# EAGLE design esp-box-emu (EAGLE 9.7.0)

## Sheet 1 of 2
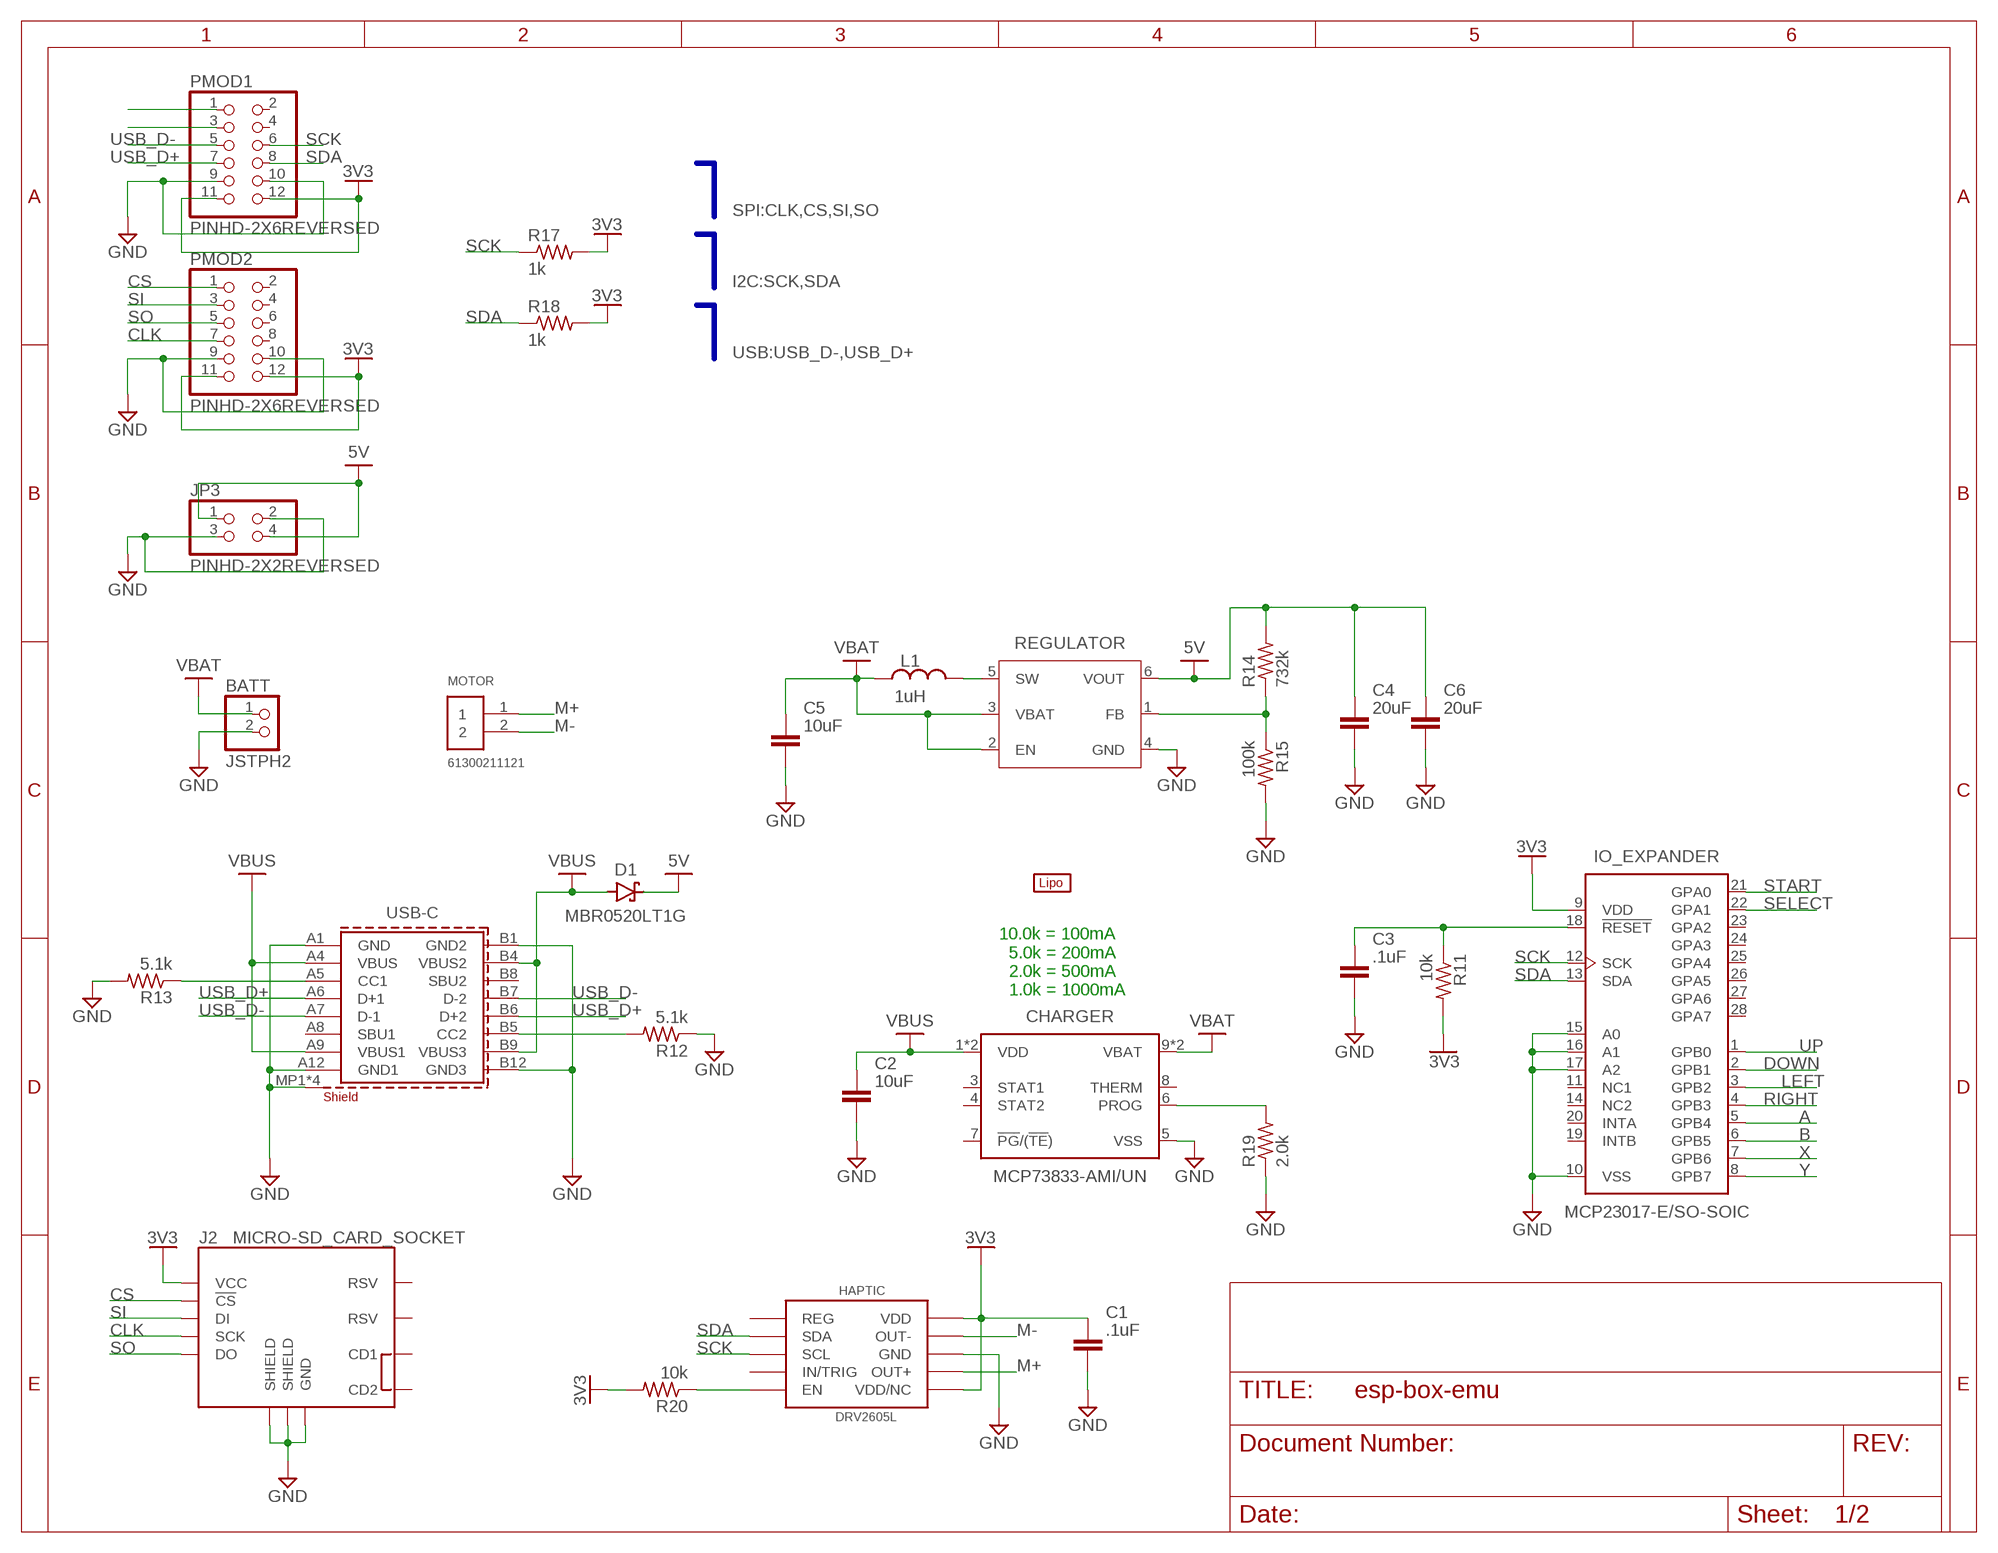
[diagram p0: schematic, sheet 1]

### Parts
BATT  JSTPH2  [JSTPH2]
BT1  LIPO-OUTLINE1100  [LIPO-1000]
C1  .1uF  C_CHIP-0603(1608-METRIC)  [CAPC1608X85]
C2  10uF  C_CHIP-0603(1608-METRIC)  [CAPC1608X85]
C3  .1uF  C_CHIP-0603(1608-METRIC)  [CAPC1608X85]
C4  20uF  C_CHIP-0805(2012-METRIC)  [CAPC2012X110]
C5  10uF  C_CHIP-0603(1608-METRIC)  [CAPC1608X85]
C6  20uF  C_CHIP-0805(2012-METRIC)  [CAPC2012X110]
CHARGER  MCP73833-AMI/UN  [SOP50P490X110-10]
D1  MBR0520LT1G  SCHOTTKY_MBR0520LT1GDO-219  [SODFL3718X115]
HAPTIC  DRV2605L  [VSSOP-10]
IO_EXPANDER  MCP23017-E/SO-SOIC  [SOIC127P1030X265-28]
J2  MICRO-SD_CARD_SOCKET  [MICRO-SD-SOCKET]
JP3  PINHD-2X2REVERSED  [2X02/EDGE_REVERSED]
L1  1uH  L_MOLDED-1210(3225-METRIC)  [INDM3225X240]
MOTOR  61300211121  [61300211121]
PMOD1  PINHD-2X6REVERSED  [2X06/EDGE_REVERSED]
PMOD2  PINHD-2X6REVERSED  [2X06/EDGE_REVERSED]
R11  10k  R-US_CHIP-0603(1608-METRIC)  [RESC1608X60]
R12  5.1k  R-US_CHIP-0603(1608-METRIC)  [RESC1608X60]
R13  5.1k  R-US_CHIP-0603(1608-METRIC)  [RESC1608X60]
R14  732k  R-US_CHIP-0603(1608-METRIC)  [RESC1608X60]
R15  100k  R-US_CHIP-0603(1608-METRIC)  [RESC1608X60]
R17  1k  R-US_CHIP-0603(1608-METRIC)  [RESC1608X60]
R18  1k  R-US_CHIP-0603(1608-METRIC)  [RESC1608X60]
R19  2.0k  R-US_CHIP-0603(1608-METRIC)  [RESC1608X60]
R20  10k  R-US_CHIP-0603(1608-METRIC)  [RESC1608X60]
REGULATOR  TPS61070  TPS61023  [SOT563]
USB-C  629722000214  629722000214SMD  [USB4110GFA]

### Nets
3V3: C1.1 HAPTIC.P$6(VDD/NC) HAPTIC.P$10(VDD) IO_EXPANDER.9(VDD) J2.VCC PMOD1.11 PMOD1.12 PMOD2.11 PMOD2.12 R11.2 R17.2 R18.2 R20.2 ; also sheet 2
5V: C4.1 C6.1 D1.1(C) JP3.1 JP3.4 R14.2 REGULATOR.6(VOUT)
A: IO_EXPANDER.5(GPB4) ; also sheet 2
B: IO_EXPANDER.6(GPB5) ; also sheet 2
CLK: J2.SCLK(SCK) PMOD2.7
CS: J2.CS(!CS) PMOD2.1
DOWN: IO_EXPANDER.2(GPB1) ; also sheet 2
GND: BATT.2 C1.2 C2.2 C3.2 C4.2 C5.2 C6.2 CHARGER.5(VSS) HAPTIC.P$8(GND) IO_EXPANDER.10(VSS) IO_EXPANDER.15(A0) IO_EXPANDER.16(A1) IO_EXPANDER.17(A2) J2.GND J2.GND1(SHIELD) J2.GND3(SHIELD) JP3.2 JP3.3 PMOD1.9 PMOD1.10 PMOD2.9 PMOD2.10 R12.1 R13.2 R15.2 R19.1 REGULATOR.4(GND) USB-C.A1(GND) USB-C.A12(GND1) USB-C.B1(GND2) USB-C.B12(GND3) USB-C.MP1(SHIELD) USB-C.MP2(SHIELD) USB-C.MP3(SHIELD) USB-C.MP4(SHIELD) ; also sheet 2
LEFT: IO_EXPANDER.3(GPB2) ; also sheet 2
M+: HAPTIC.P$7(OUT+) MOTOR.1
M-: HAPTIC.P$9(OUT-) MOTOR.2
N$2: C3.1 IO_EXPANDER.18(!RESET) R11.1
N$3: R12.2 USB-C.B5(CC2)
N$4: R13.1 USB-C.A5(CC1)
N$5: PMOD1.3
N$6: PMOD1.1
N$7: R14.1 R15.1 REGULATOR.1(FB)
N$8: L1.2 REGULATOR.5(SW)
N$9: CHARGER.6(PROG) R19.2
N$11: HAPTIC.P$5(EN) R20.1
RIGHT: IO_EXPANDER.4(GPB3) ; also sheet 2
SCK: HAPTIC.P$2(SCL) IO_EXPANDER.12(SCK) PMOD1.6 R17.1
SDA: HAPTIC.P$3(SDA) IO_EXPANDER.13(SDA) PMOD1.8 R18.1
SELECT: IO_EXPANDER.22(GPA1) ; also sheet 2
SI: J2.DI PMOD2.3
SO: J2.DO PMOD2.5
START: IO_EXPANDER.21(GPA0) ; also sheet 2
UP: IO_EXPANDER.1(GPB0) ; also sheet 2
USB_D+: PMOD1.7 USB-C.A6(D+1) USB-C.B6(D+2)
USB_D-: PMOD1.5 USB-C.A7(D-1) USB-C.B7(D-2)
VBAT: BATT.1 C5.1 CHARGER.9(VBAT) CHARGER.10(VBAT) L1.1 REGULATOR.2(EN) REGULATOR.3(VBAT)
VBUS: C2.1 CHARGER.1(VDD) CHARGER.2(VDD) D1.2(A) USB-C.A4(VBUS) USB-C.A9(VBUS1) USB-C.B4(VBUS2) USB-C.B9(VBUS3)
X: IO_EXPANDER.7(GPB6) ; also sheet 2
Y: IO_EXPANDER.8(GPB7) ; also sheet 2
Unconnected: CHARGER.3(STAT1) CHARGER.4(STAT2) CHARGER.7(!PG!/(!TE!)) CHARGER.8(THERM) HAPTIC.P$1(REG) HAPTIC.P$4(IN/TRIG) IO_EXPANDER.11(NC1) IO_EXPANDER.14(NC2) IO_EXPANDER.19(INTB) IO_EXPANDER.20(INTA) IO_EXPANDER.23(GPA2) IO_EXPANDER.24(GPA3) IO_EXPANDER.25(GPA4) IO_EXPANDER.26(GPA5) IO_EXPANDER.27(GPA6) IO_EXPANDER.28(GPA7) J2.CD1 J2.CD2 J2.RSV1(RSV) J2.RSV2(RSV) PMOD1.2 PMOD1.4 PMOD2.2 PMOD2.4 PMOD2.6 PMOD2.8 USB-C.A8(SBU1) USB-C.B8(SBU2)

### Buses
SPI:CLK,CS,SI,SO
I2C:SCK,SDA
USB:USB_D-,USB_D+

### Notes on the sheet
- 10.0k = 100mA
    5.0k = 200mA
    2.0k = 500mA
    1.0k = 1000mA

## Sheet 2 of 2
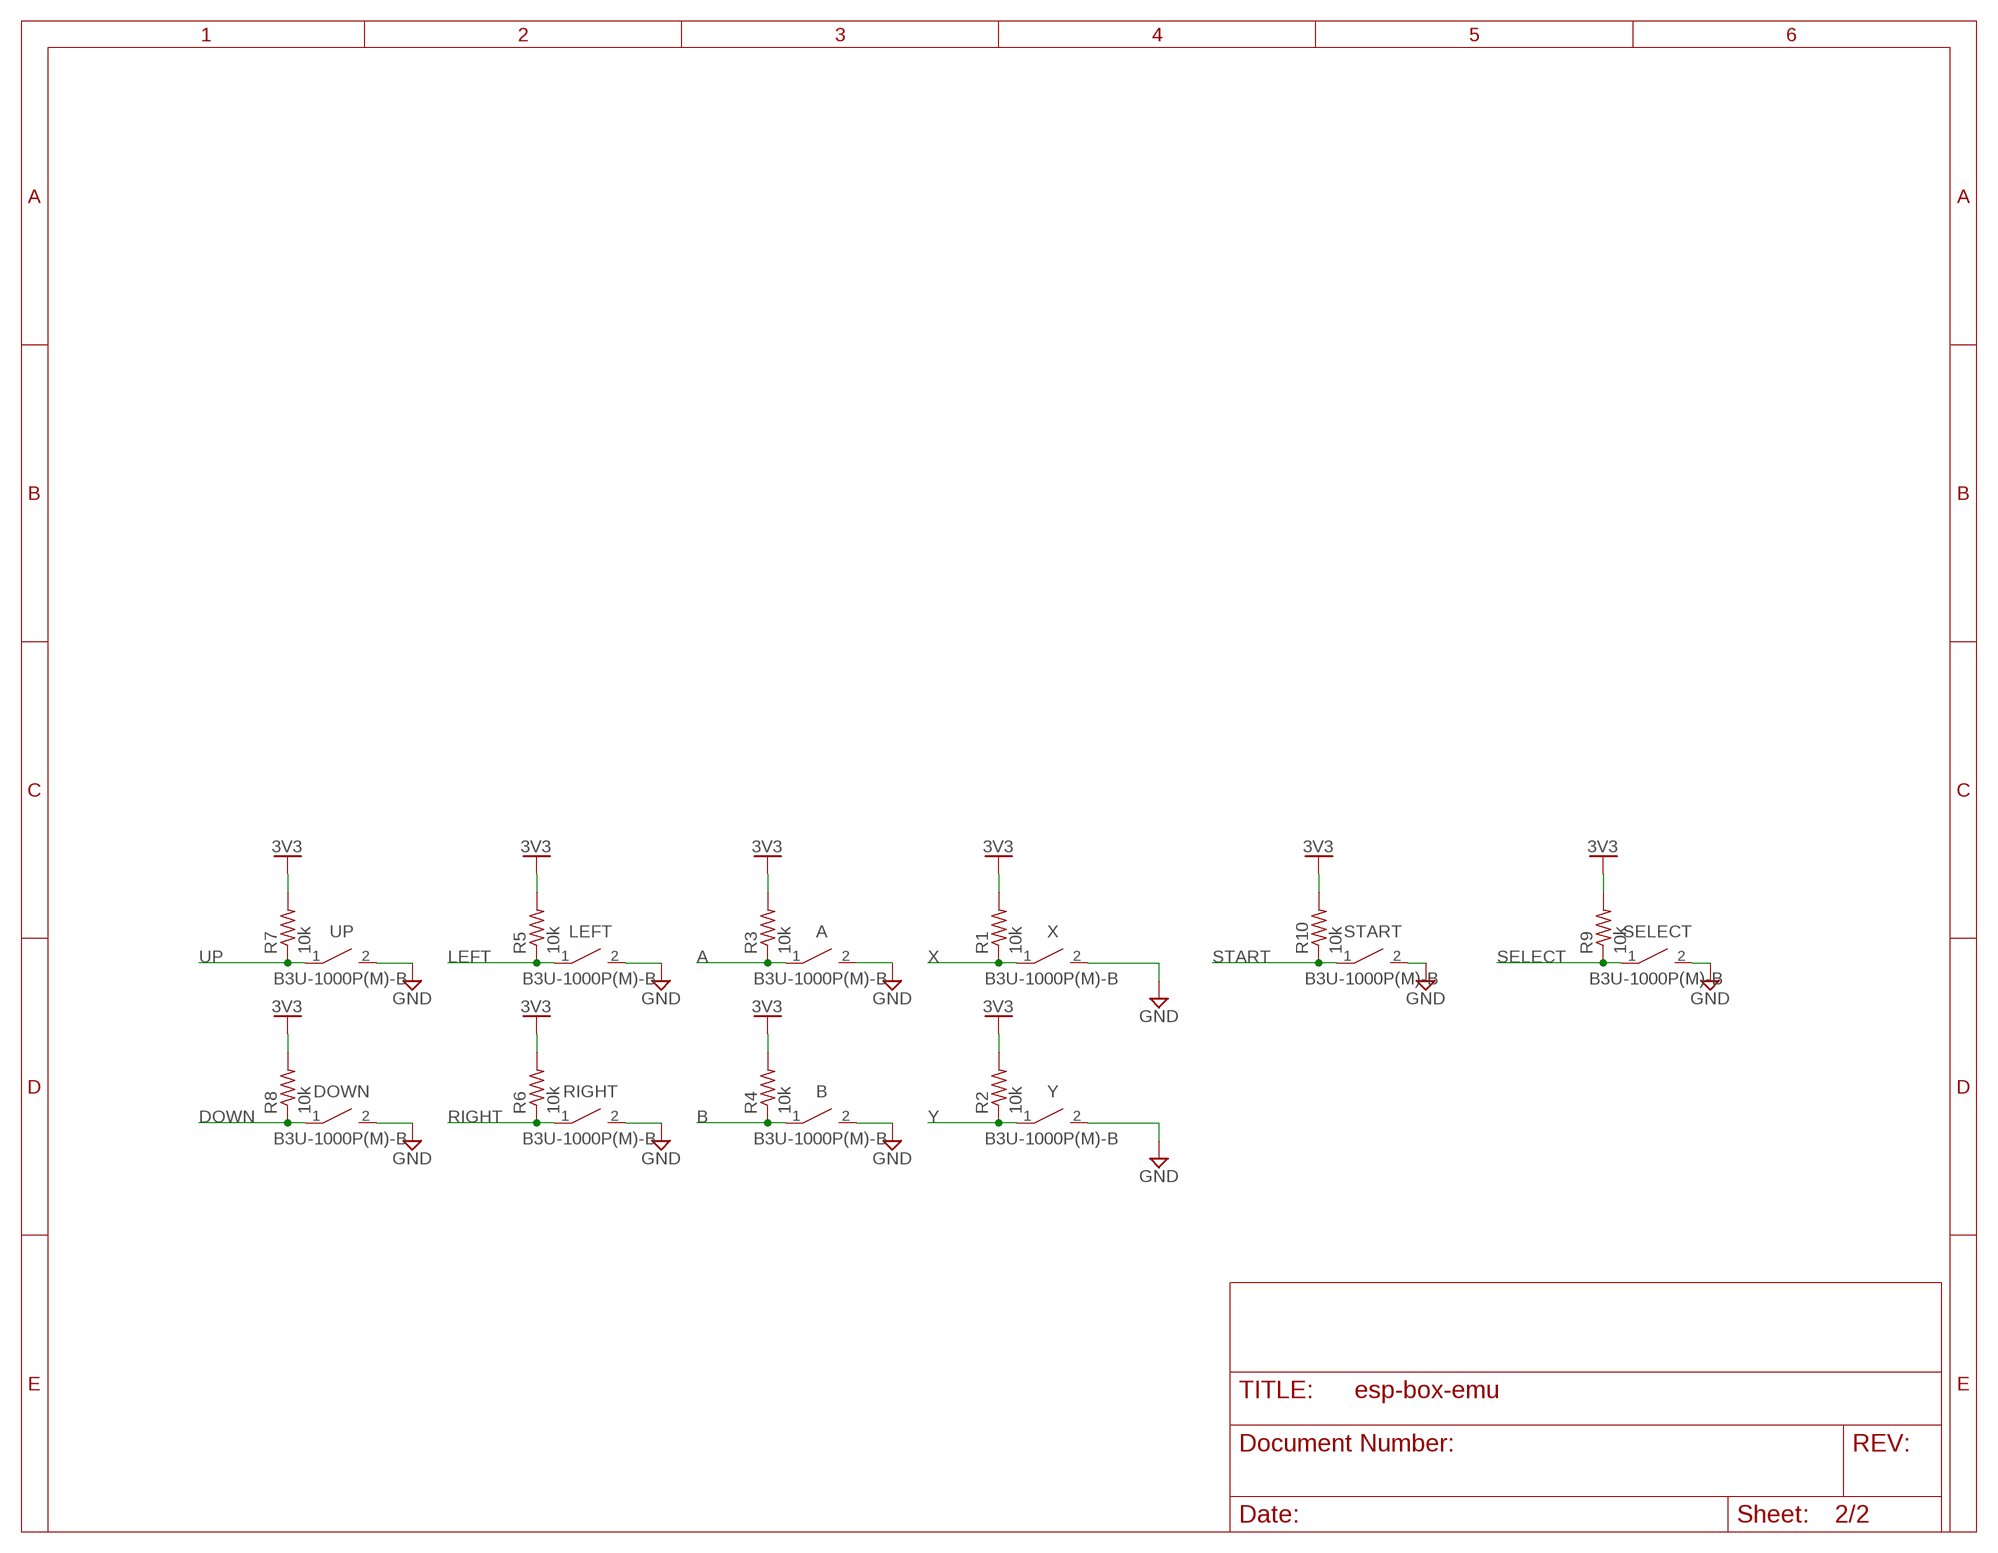
[diagram p1: schematic, sheet 2]

### Parts
A  B3U-1000P(M)-B  B3U-X000B3U-1000P(M)-B1000P(M)-B  [B3U-1000P(M)-B]
B  B3U-1000P(M)-B  B3U-X000B3U-1000P(M)-B1000P(M)-B  [B3U-1000P(M)-B]
DOWN  B3U-1000P(M)-B  B3U-X000B3U-1000P(M)-B1000P(M)-B  [B3U-1000P(M)-B]
LEFT  B3U-1000P(M)-B  B3U-X000B3U-1000P(M)-B1000P(M)-B  [B3U-1000P(M)-B]
R1  10k  R-US_CHIP-0603(1608-METRIC)  [RESC1608X60]
R2  10k  R-US_CHIP-0603(1608-METRIC)  [RESC1608X60]
R3  10k  R-US_CHIP-0603(1608-METRIC)  [RESC1608X60]
R4  10k  R-US_CHIP-0603(1608-METRIC)  [RESC1608X60]
R5  10k  R-US_CHIP-0603(1608-METRIC)  [RESC1608X60]
R6  10k  R-US_CHIP-0603(1608-METRIC)  [RESC1608X60]
R7  10k  R-US_CHIP-0603(1608-METRIC)  [RESC1608X60]
R8  10k  R-US_CHIP-0603(1608-METRIC)  [RESC1608X60]
R9  10k  R-US_CHIP-0603(1608-METRIC)  [RESC1608X60]
R10  10k  R-US_CHIP-0603(1608-METRIC)  [RESC1608X60]
RIGHT  B3U-1000P(M)-B  B3U-X000B3U-1000P(M)-B1000P(M)-B  [B3U-1000P(M)-B]
SELECT  B3U-1000P(M)-B  B3U-X000B3U-1000P(M)-B1000P(M)-B  [B3U-1000P(M)-B]
START  B3U-1000P(M)-B  B3U-X000B3U-1000P(M)-B1000P(M)-B  [B3U-1000P(M)-B]
UP  B3U-1000P(M)-B  B3U-X000B3U-1000P(M)-B1000P(M)-B  [B3U-1000P(M)-B]
X  B3U-1000P(M)-B  B3U-X000B3U-1000P(M)-B1000P(M)-B  [B3U-1000P(M)-B]
Y  B3U-1000P(M)-B  B3U-X000B3U-1000P(M)-B1000P(M)-B  [B3U-1000P(M)-B]

### Nets
3V3: R1.2 R2.2 R3.2 R4.2 R5.2 R6.2 R7.2 R8.2 R9.2 R10.2 ; also sheet 1
A: A.1 R3.1 ; also sheet 1
B: B.1 R4.1 ; also sheet 1
DOWN: DOWN.1 R8.1 ; also sheet 1
GND: A.2 B.2 DOWN.2 LEFT.2 RIGHT.2 SELECT.2 START.2 UP.2 X.2 Y.2 ; also sheet 1
LEFT: LEFT.1 R5.1 ; also sheet 1
RIGHT: R6.1 RIGHT.1 ; also sheet 1
SELECT: R9.1 SELECT.1 ; also sheet 1
START: R10.1 START.1 ; also sheet 1
UP: R7.1 UP.1 ; also sheet 1
X: R1.1 X.1 ; also sheet 1
Y: R2.1 Y.1 ; also sheet 1

## Library data of the parts
A B DOWN LEFT RIGHT SELECT START UP X Y = Switch:B3U-X000: Ultra-small Tactile Switch Contact form : SPST-NO Datasheet <https://omronfs.omron.com/en_US/ecb/products/pdf/en-b3u.pdf>; CATEGORY: Switch; DESCRIPTION: Ultra-small Surface-mounting Tactile Switches with High Contact Reliability; MANUFACTURER: OMRON; OPERATING_TEMPERATURE: -25°C to +70°C at 60%RH max; PART_STATUS: ACTIVE; ROHS_COMPLIANCE: RoHS Compliant; SERIES: B3U; TYPE: Tactile
BATT = Tutorial - Fusion 360:JSTPH2
BT1 = SparkFun-Batteries:LIPO-OUTLINE: LiPo Battery Outlines Outlines for common LiPo batteries sold by SparkFun. (Note: no terminals or connection points, just the dimensions.) SparkFun Products Polymer Lithium Ion Battery - 110mAh <https://www.sparkfun.com/products/13853> (PRT-13853) Polymer Lithium Ion Battery - 1000mAh <https://www.sparkfun.com/products/13813> (PRT-13813) Polymer Lithium Ion Battery - 2000mAh <https://www.sparkfun.com/products/8483> (PRT-08483); PROD_ID: BATT-13243; SF_SKU: PRT-13813
C1-C6 = Capacitor:C: Capacitor - Generic; CATEGORY: Capacitor
CHARGER = IC_Power-Management:MCP7383*: Li-Ion / Li-Polymer Charge Management Controller Datasheet <https://ww1.microchip.com/downloads/en/DeviceDoc/22005b.pdf>; CATEGORY: IC_Power-Management; DESCRIPTION: Charger IC Lithium Ion/Polymer 10-MSOP; MANUFACTURER: Microchip Technology; MPN: MCP73833-AMI/UN; OPERATING_TEMP: -40°C to 125°C; PART_STATUS: Active; ROHS_COMPLIANT: COMPLIANT; SERIES: -; SUB-CATEGORY: Battery Charger
D1 = Diode:SCHOTTKY_: Schottky Diode - Popular parts; CATEGORY: Diode; DESCRIPTION: DIODE SCHOTTKY 20V 500MA SOD123; MANUFACTURER: ON Semiconductor; MPN: MBR0520LT1G; SUB-CATEGORY: Schottky
HAPTIC = SparkFun-IC-Special-Function:DRV2605L; PROD_ID: IC-13504
IO_EXPANDER = IC_Interface:MCP23017*: 16-Bit I/O Expander with Serial Interface Datasheet <https://ww1.microchip.com/downloads/en/devicedoc/20001952c.pdf>; CATEGORY: IC_Interface; DESCRIPTION: I/O Expander 16 I²C 1.7MHz; MANUFACTURER: Microchip Technology; MPN: MCP23017-E/SO; OPERATING_TEMP: -40°C to 125°C; PART_STATUS: Active; ROHS_COMPLIANT: ROHS3 Compliant; SUB-CATEGORY: I/O Expander; TYPE: 16 bit
J2 = SparkFun-Connectors:MICRO-SD_CARD_SOCKET: microSD Socket for Transflash Push-push type µSD socket. tDoc lines correctly indicate media card edge positions when inserting (unlocked, locked, depressed). NOTE: CD1 and CD2 are connected internally, and the default detect state of the socket is detect pin to ground. SparkFun Products: WAV Trigger <https://www.sparkfun.com/products/13660> CAN-Bus Shield <https://www.sparkfun.com/products/13262> SparkFun Level Shifing microSD Breakout <https://www.sparkfun.com/products/13743>; PROD_ID: CONN-07820; SF_ID: PRT-00127
JP3 = My Connectors:PINHD-2X2: PIN HEADER
L1 = Inductor:L: Inductor Fixed - Generic; CATEGORY: Inductor; SUB-CATEGORY: Fixed
MOTOR = Headers:61300211121: CONN HEADER VERT 2POS 2.54MM Manufacturer's datasheet <https://katalog.we-online.de/em/datasheet/6130xx11121.pdf>; CREATED_BY: PCBLayout.com; DIGI_KEY_PART_NUMBER: 732-5315-ND; MANUFACTURER: Wurth Electronics Inc.; MPN: 61300211121
PMOD1 PMOD2 = My Connectors:PINHD-2X6: PIN HEADER
R1-R15 R17-R20 = Tutorial - Fusion 360:R-US: Resistor Fixed - ANSI; CATEGORY: Resistor; SUB-CATEGORY: Fixed
REGULATOR = Library:TPS61023: Synchronous Boost Converter With 600-mA Switch Datasheet <https://www.ti.com/lit/ds/symlink/tps61070.pdf?ts=1593507986589&ref_url=https%253A%252F%252Fwww.ti.com%252Fstore%252Fti%252Fen%252Fp%252Fproduct%252F%253Fp%253DTPS61070DDCR>
USB-C = Wurth_Connectors_WR-USB:629722000214: WR-COM USB 2.0 Type C Plug Vertical SMT Kind Properties Durability 10 000 Mating cycles Gender Receptacle Type Horizontal General Information Operating Temperature -40 up to +85 °C Electrical Properties Working Voltage 20 V (DC) Withstanding Voltage 100 V (AC) Contact Resistance 40 mΩ Material Properties Insulator Material LCP Insulator Flammability Rating UL94 V-0 Insulator Color Black Contact Material Brass Contact Plating Gold over Nickel Contact Type Stamped Shielding Material Steel Shielding Plating Nickel (Ni) <https://www.we-online.com/catalog/media/o689297v209%20family-wr-com-629722000214.jpg> Details see: www.we-online.com/catalog/WR-COM_USB_20_TYPE_C_RECEPTACLE_HORIZONTAL_SMT <www.we-online.com/catalog/WR-COM_USB_20_TYPE_C_RECEPTACLE_HORIZONTAL_SMT/?utm_source=eagle_model&utm_medium=description_link&utm_campaign=eisos_eagle> Updated by Ella Wu 2022-11-15 2022 (C) Würth Elektronik

## Board
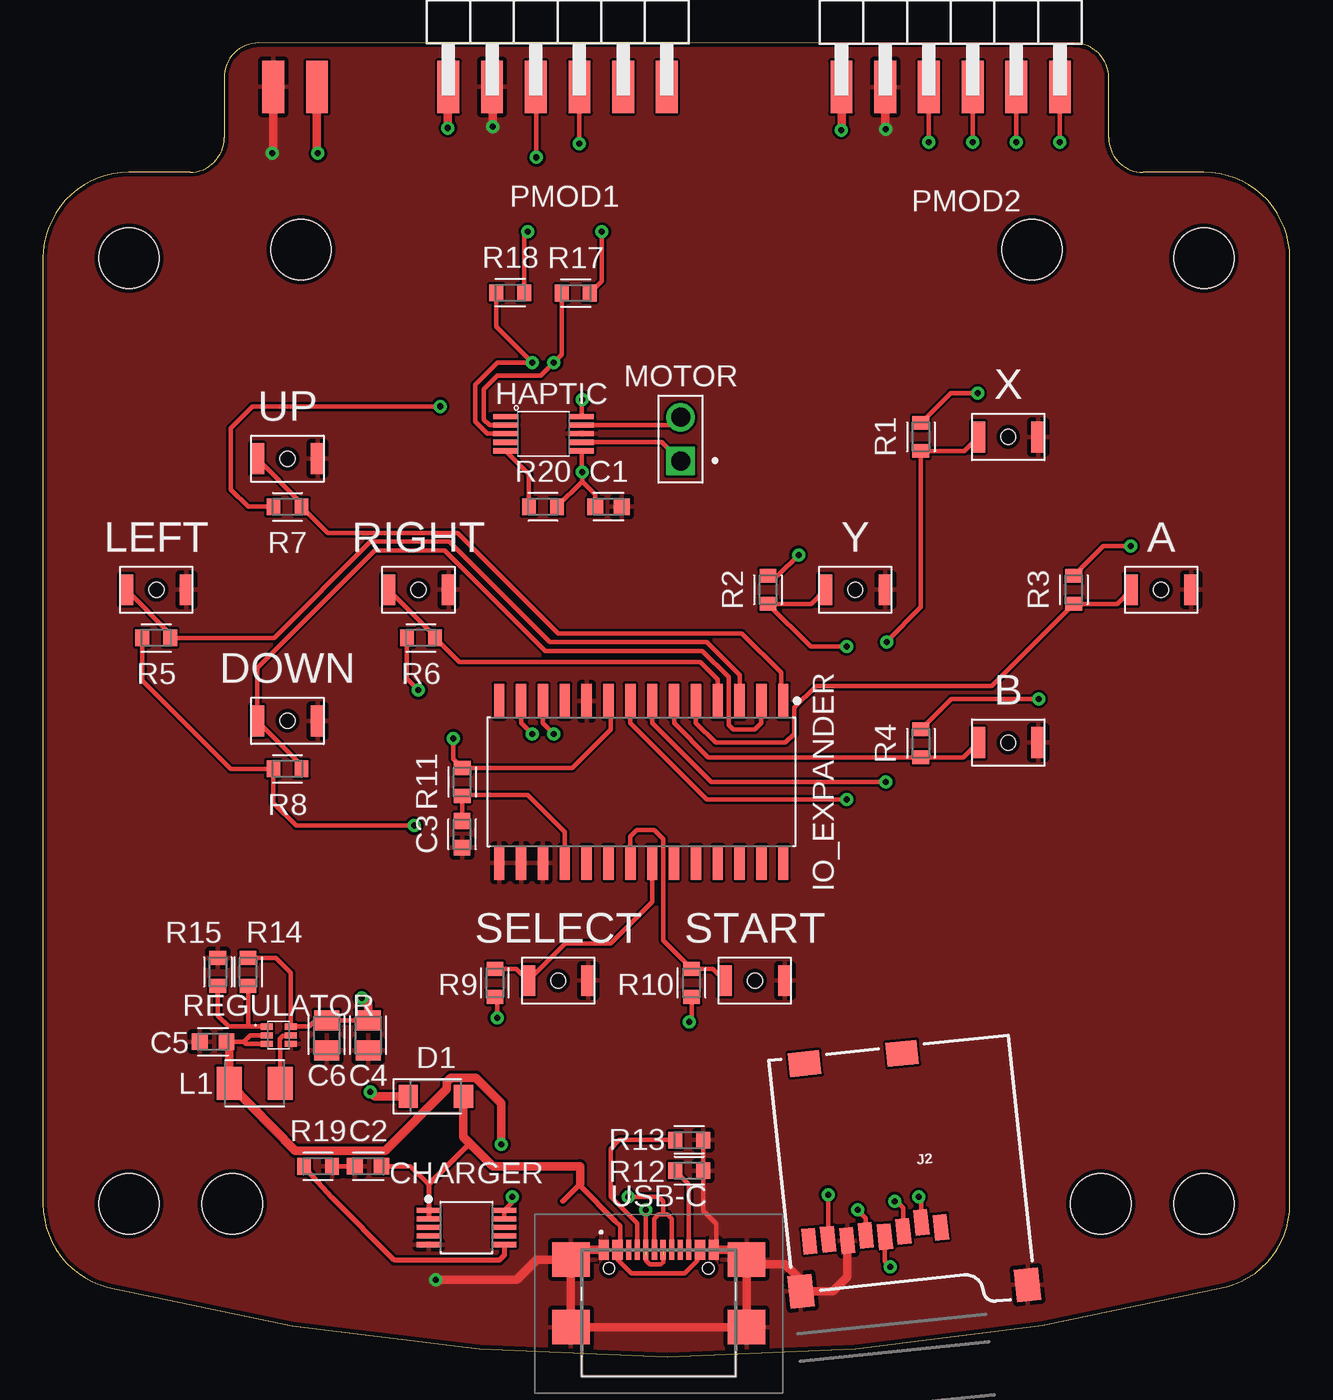
[diagram p2: board, top side]
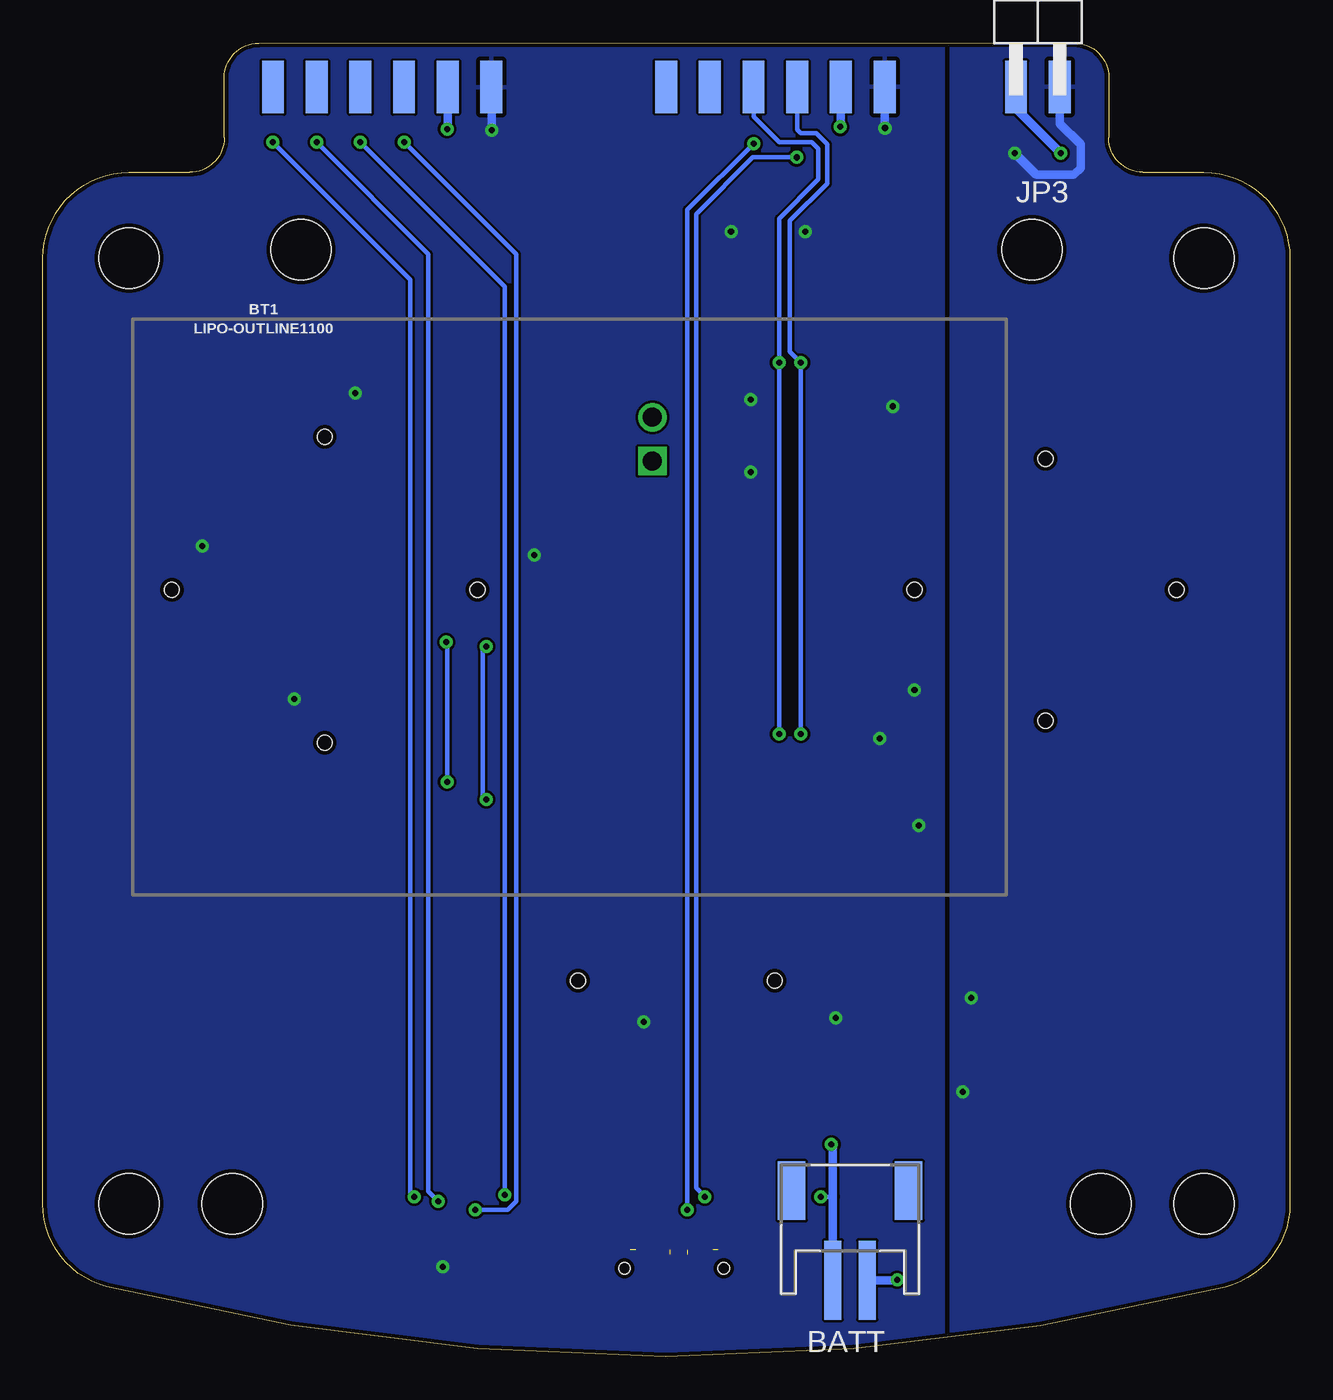
[diagram p3: board, bottom side, seen from below]

Size 72.5 x 76.4 mm. Coordinates in mm from the lower left corner, seen from the top.
Outline: 8.55,68.88 5,68.88 arc90 0,63.88 0,8.89 arc76 3.78,4.04 arc28 68.8,4.05 arc75 72.5,8.88 72.5,63.88 arc90 67.5,68.88 63.96,68.88 arc-90 61.96,70.88 61.96,74.38 arc90 59.96,76.38 12.52,76.4 arc90 10.54,74.4 10.54,70.88 arc-90 8.55,68.88
Copper layers (1*16): Top 0.035mm / dielectric 1.5mm / Bottom 0.035mm
Design rules "default *": minimum track width 6mil, minimum drill 0.35mm, track to track 6mil, track to pad 6mil, pad to pad 6mil, via to via 6mil, smd to smd 6mil, copper to edge 10mil, drill to drill 6mil, minimum pad ring 10mil, minimum via ring 8mil, stop-mask expansion 4mil, vias tented up to drill 0mil, thermal gap 10mil
Holes 3.5 mm at 67.5,63.88 5,63.88 5,8.89 67.5,8.88 15,64.38 57.5,64.38 11,8.88 61.5,8.88

### Footprints (pad centres in the part's own frame; a part is rotated, then mirrored left to right if it is on the bottom)
B3U-1000P(M)-B = smd 0.8 x 1.8: 1 -1.75,0; 2 1.75,0 | hole 0.85: 0,0
JSTPH2 = smd 1 x 4.6: 1 -1,-3.7; 2 1,-3.7 | smd 1.6 x 3.4: NC1 -3.4,1.5; NC2 3.4,1.5
CAPC1608X85 = smd 0.921 x 0.97: 1 -0.775,0; 2 0.775,0
CAPC2012X110 = smd 1.165 x 1.465: 1 -0.875,0; 2 0.875,0
SOP50P490X110-10 = smd 1.4 x 0.3: 1 -2.2,1; 2 -2.2,0.5; 3 -2.2,0; 4 -2.2,-0.5; 5 -2.2,-1; 6 2.2,-1; 7 2.2,-0.5; 8 2.2,0; 9 2.2,0.5; 10 2.2,1
SODFL3718X115 = smd 1.115 x 1.361: 1 -1.6,0; 2 1.6,0
VSSOP-10 = smd 1.45 x 0.3: P$1 -1.905,1.06; P$2 -1.905,0.56; P$3 -1.905,0.06; P$4 -1.905,-0.44; P$5 -1.905,-0.94; P$6 2.495,-0.94; P$7 2.495,-0.44; P$8 2.495,0.06; P$9 2.495,0.56; P$10 2.495,1.06
SOIC127P1030X265-28 = smd 2 x 0.6: 1 -4.7,8.255; 2 -4.7,6.985; 3 -4.7,5.715; 4 -4.7,4.445; 5 -4.7,3.175; 6 -4.7,1.905; 7 -4.7,0.635; 8 -4.7,-0.635; 9 -4.7,-1.905; 10 -4.7,-3.175; 11 -4.7,-4.445; 12 -4.7,-5.715; 13 -4.7,-6.985; 14 -4.7,-8.255; 15 4.7,-8.255; 16 4.7,-6.985; 17 4.7,-5.715; 18 4.7,-4.445; 19 4.7,-3.175; 20 4.7,-1.905; 21 4.7,-0.635; 22 4.7,0.635; 23 4.7,1.905; 24 4.7,3.175; 25 4.7,4.445; 26 4.7,5.715; 27 4.7,6.985; 28 4.7,8.255
MICRO-SD-SOCKET = smd 1.8 x 1.4: CD1 -2.05,0.4; CD2 -7.75,0.4 | smd 0.8 x 1.5: CS -7.84,10.3; DI -6.74,10.7; DO -2.34,10.7; GND -3.44,10.9; RSV1 -8.94,10.7; RSV2 -1.24,10.7; SCLK -4.54,10.7; VCC -5.64,10.9 | smd 1.4 x 1.9: GND1 -13.6,14.55; GND3 -0.45,13.55
2X02/EDGE_REVERSED = smd 1.27 x 3.048: 1 1.27,-2.794; 3 -1.27,-2.794 | smd 1.27 x 3.048 bottom: 2 1.27,-2.794; 4 -1.27,-2.794
INDM3225X240 = smd 1.459 x 1.929: 1 -1.478,0; 2 1.478,0
61300211121 = drill 1.1 square: 1 -1.27,0 | drill 1.1: 2 1.27,0
2X06/EDGE_REVERSED = smd 1.27 x 3.048: 1 6.35,3.556; 3 3.81,3.556; 5 1.27,3.556; 7 -1.27,3.556; 9 -3.81,3.556; 11 -6.35,3.556 | smd 1.27 x 3.048 bottom: 2 6.35,3.556; 4 3.81,3.556; 6 1.27,3.556; 8 -1.27,3.556; 10 -3.81,3.556; 12 -6.35,3.556
RESC1608X60 = smd 0.799 x 0.974: 1 -0.815,0; 2 0.815,0
SOT563 = smd 0.7 x 0.35: 1 -0.7,0.5; 2 -0.7,0; 3 -0.7,-0.5; 4 0.7,-0.5; 5 0.7,0; 6 0.7,0.5
USB4110GFA = smd 0.3 x 1.15: A1 -3.35,3.678; A4 -2.55,3.678; A5 -1.25,3.678; A6 -0.25,3.678; A7 0.25,3.678; A8 1.25,3.678; A9 2.55,3.678; A12 3.35,3.678; B1 3.05,3.678; B4 2.25,3.678; B5 1.75,3.678; B6 0.75,3.678; B7 -0.75,3.678; B8 -1.75,3.678; B9 -2.25,3.678; B12 -3.05,3.678 | smd 2.18 x 2: MP1 -5.11,-0.827; MP2 5.11,-0.827; MP3 -5.11,3.103; MP4 5.11,3.103 | hole 0.65: -2.89,2.603; 2.89,2.603

### Placement (x,y rotation side)
A  65.01,44.6 0 top
B  56.12,35.71 0 top
BATT  25.58,8.14 0 bottom
BT1  67.3,60.34 270 bottom
C1  32.88,49.42 0 top
C2  18.91,11.07 180 top
C3  24.37,30.37 270 top
C4  18.91,18.69 270 top
C5  9.89,18.31 180 top
C6  16.5,18.69 270 top
CHARGER  24.62,7.51 0 top
D1  22.85,15.13 0 top
DOWN  14.21,36.98 0 top
HAPTIC  28.81,53.61 0 top
IO_EXPANDER  34.78,33.42 270 top
J2  42.2,17.22 186 top
JP3  14.66,76.63 0 bottom
L1  12.3,15.89 0 top
LEFT  6.59,44.6 0 top
MOTOR  37.07,53.36 90 top
PMOD1  29.92,70.28 0 top
PMOD2  52.78,70.27 0 top
R1  51.04,53.49 90 top
R2  42.15,44.6 90 top
R3  59.93,44.6 90 top
R4  51.04,35.66 90 top
R5  6.59,41.8 180 top
R6  21.98,41.8 180 top
R7  14.21,49.42 180 top
R8  14.21,34.18 180 top
R9  26.27,21.74 270 top
R10  37.7,21.74 270 top
R11  24.37,33.42 90 top
R12  37.58,10.81 180 top
R13  37.58,12.59 0 top
R14  11.92,22.37 90 top
R15  10.17,22.37 90 top
R17  30.97,61.85 0 top
R18  27.16,61.87 0 top
R19  15.99,11.07 180 top
R20  29.07,49.42 0 top
REGULATOR  13.7,18.69 0 top
RIGHT  21.83,44.6 0 top
SELECT  29.96,21.86 0 top
START  41.39,21.86 0 top
UP  14.21,52.22 0 top
USB-C  35.8,2.53 0 top
X  56.12,53.49 0 top
Y  47.23,44.6 0 top

### Tracks (layer width: path | path; a pad name or v marks a point on that pad's centre or on a via)
3V3  (via drill 0.35)
  Top 0.254: IO_EXPANDER.9 33.01,37.99 33.01,36.47 30.77,34.23 R11.2 23.86,34.74 v23.86,35.96 | R1.2 52.77,56.03 v54.34,56.03 | R3.2 61.66,47.14 v63.23,47.14 | R4.2 52.81,38.25 v57.9,38.25 | R2.2 42.71,45.41 v43.93,46.63 | R5.2 5.77,39.31 10.91,34.18 R8.2 13.39,32.2 14.72,30.88 v21.58,30.88 | R7.2 11.92,49.42 10.91,50.44 10.91,53.99 12.18,55.26 v23.1,55.26 | R18.2 27.98,65.22 v28.18,65.42 | R17.2 32.5,62.56 v32.5,65.42 | R6.2 21.16,39.42 v21.83,38.75 | R9.2 26.4,20.79 v26.4,19.7 | R10.2 37.7,19.58 v37.58,19.45 | J2.VCC 48.95,5.54 v49.26,5.23 | HAPTIC.P$6 31.31,51.5 v31.35,51.45 31.35,50.89 | R20.2 31.35,50.89 | HAPTIC.P$10 31.31,55.6 v31.35,55.64 | C1.1 32.1,50.14 31.35,50.89
  Top 0.508: PMOD2.12 46.43,71.43 46.47,71.39 v46.4,71.33 | v23.54,71.46 23.54,73.82 PMOD1.12
  Bottom 0.508: v46.4,71.33 46.4,73.8 PMOD2.12 | PMOD1.12 23.57,71.56 23.61,71.52 v23.54,71.46
  pour Bottom: 20.18,-1 73.27,-1 73.27,76.47 20.18,76.47
5V  (via drill 0.35)
  Top 0.254: R14.2 13.52,23.19 14.4,22.31 REGULATOR.6 15.47,19.19 15.75,19.46 C6.1 C4.1
  Top 0.508: D1.1 19.29,15.13 v19.04,15.39 | JP3.4 15.93,70.03 v15.99,69.98 | C4.1 18.91,20.47 v18.53,20.85
  Bottom 0.508: JP3.1 13.39,71.71 12.18,70.5 12.18,69.11 12.56,68.73 14.74,68.73 v15.99,69.98
  pour Bottom: -0.14,-1 19.67,-1 19.67,76.47 -0.14,76.47
A
  Top 0.254: A.1 62.44,43.78 R3.1 55.16,39.01 44.94,39.01 43.67,37.74 43.67,36.21 43.17,35.71 39.1,35.71 37.96,36.85 IO_EXPANDER.5
B
  Top 0.254: B.1 53.51,34.85 R4.1 38.69,34.85 36.69,36.85 IO_EXPANDER.6
CLK  (via drill 0.35)
  Top 0.254: PMOD2.7 v51.51,70.63 | J2.SCLK 47.84,8.05 v47.36,8.53
  Bottom 0.254: v51.51,70.63 44.99,64.11 44.99,9.02 45.48,8.53 v47.36,8.53
CS  (via drill 0.35)
  Top 0.254: PMOD2.1 v59.13,70.63 | J2.CS 51.08,9.13 v50.91,9.29
  Bottom 0.254: v59.13,70.63 51.14,62.64 51.14,9.52 v50.91,9.29
DOWN
  Top 0.254: R8.1 15.02,34.41 DOWN.1 12.46,40.05 19.29,46.88 23.35,46.88 29.2,41.04 38.34,41.04 39.86,39.52 39.86,36.72 40.12,36.47 41.39,36.47 41.77,36.85 IO_EXPANDER.2
GND  (via drill 0.35)
  Top 0.254: R13.2 R12.1 38.39,8.47 39.15,7.72 USB-C.A12 | R19.1 C2.2
  Top 0.508: v49.01,71.39 48.97,71.43 PMOD2.10 | PMOD1.10 26.15,73.8 v26.15,71.52 | JP3.2 13.39,70.06 v13.32,70 | J2.GND 46.76,4.63 45.93,3.8 J2.GND3 44.06,4.45 43.14,5.37 40.91,5.37 | 40.91,5.37 | 40.91,5.37 USB-C.MP4 40.34,6.21 USB-C.A12 | 40.91,5.37 USB-C.MP2 | USB-C.MP2 | USB-C.MP3 USB-C.MP1 USB-C.MP2 | USB-C.MP3 31.27,6.21 USB-C.A1 | USB-C.MP3 28.72,5.64 27.55,4.46 v22.85,4.46
  Bottom 0.508: BATT.2 22.87,4.44 v22.85,4.46 | PMOD2.10 48.97,71.43 v49.01,71.39 | v26.15,71.52 26.11,71.56 PMOD1.10 | JP3.3 15.93,72.6 v13.32,70
  pour Top: -0.14,-1 73.27,-1 73.27,76.47 -0.14,76.47
LEFT
  Top 0.254: LEFT.1 7.41,42.03 R5.1 13.45,41.8 19.04,47.39 23.61,47.39 29.45,41.55 38.59,41.55 40.5,39.64 IO_EXPANDER.3
M+
  Top 0.254: HAPTIC.P$7 35.99,53.17 MOTOR.1
M-
  Top 0.254: HAPTIC.P$9 36.61,54.17 MOTOR.2
N$2
  Top 0.254: IO_EXPANDER.18 30.34,30.5 28.18,32.66 24.42,32.66 R11.1 C3.1
N$3
  Top 0.254: R12.2 37.55,10.03 USB-C.B5
N$4
  Top 0.254: R13.1 33.51,12.59 33.01,12.08 33.01,9.29 34.55,7.75 USB-C.A5
N$7
  Top 0.254: R15.1 10.17,19.81 10.79,19.19 11.92,19.19 | 11.92,19.19 REGULATOR.1 | R14.1 11.92,19.19
N$8
  Top 0.254: REGULATOR.5 14.36,18.64 13.94,18.64 13.77,18.48 13.77,17.9 13.78,17.89 L1.2
N$9
  Top 0.305: R19.2 16.8,9.24 20.43,5.61 26.53,5.61 26.82,5.9 CHARGER.6
N$11
  Top 0.254: HAPTIC.P$5 28.25,51.33 R20.1
RIGHT
  Top 0.254: RIGHT.1 22.79,41.88 R6.1 24.19,40.4 38.21,40.4 39.23,39.39 IO_EXPANDER.4
SCK  (via drill 0.35)
  Top 0.254: R17.1 30.16,58.26 v29.7,57.8 28.94,57.04 26.4,57.04 25.64,56.28 25.64,54.5 25.97,54.17 HAPTIC.P$2 | v29.7,36.21 29.07,36.85 IO_EXPANDER.12
  Bottom 0.254: v29.7,36.21 v29.7,57.8 29.7,66.19 27.42,68.47 27.42,70.25 27.8,70.63 29.7,70.63 31.19,72.12 PMOD1.6
SDA  (via drill 0.35)
  Top 0.254: R18.1 26.35,59.89 v28.43,57.8 26.4,57.8 25.13,56.53 25.13,54.37 25.83,53.67 HAPTIC.P$3 | v28.43,36.21 27.8,36.85 IO_EXPANDER.13
  Bottom 0.254: v28.43,36.21 v28.43,57.8 29.07,58.44 29.07,66.06 26.91,68.22 26.91,70.5 27.55,71.14 28.43,71.14 28.65,71.35 PMOD1.8
SELECT
  Top 0.254: R9.1 27.52,22.55 SELECT.1 30.37,24.02 33.01,24.02 35.42,26.43 IO_EXPANDER.22
SI  (via drill 0.35)
  Top 0.254: PMOD2.3 v56.59,70.63 | J2.DI 50.02,8.66 49.64,9.04 v49.52,9.04
  Bottom 0.254: v56.59,70.63 50.09,64.13 50.09,9.61 v49.52,9.04
SO  (via drill 0.35)
  Top 0.254: PMOD2.5 v54.05,70.63 | v45.65,9.42 J2.DO
  Bottom 0.254: v54.05,70.63 45.65,62.23 v45.65,9.42
START
  Top 0.254: IO_EXPANDER.21 34.15,30.24 34.53,30.63 35.55,30.63 36.05,30.12 36.05,24.2 R10.1 38.95,22.55 START.1
UP
  Top 0.254: UP.1 15.02,49.65 R7.1 16.55,47.9 24.12,47.9 29.96,42.06 40.63,42.06 42.91,39.77 42.91,38.25 IO_EXPANDER.1
USB_D+  (via drill 0.35)
  Top 0.254: 36.05,8.27 35.8,8.27 35.55,8.02 USB-C.A6 | 36.05,8.27 36.31,8.27 36.56,8.02 36.56,6.22 USB-C.B6 | 36.05,8.27 36.05,9.04 35.8,9.29 v34.02,9.29 | v28.69,69.74 28.69,73.8 PMOD1.7
  Bottom 0.254: v34.02,9.29 34.53,9.8 34.53,66.44 31.23,69.74 v28.69,69.74
USB_D-  (via drill 0.35)  (2 unrouted)
  Top 0.254: v31.19,70.54 PMOD1.5 | 35.05,5.95 35.04,5.96 35.04,5.6 35.29,5.35 35.93,5.35 36.05,5.48 USB-C.A7 | USB-C.B7 35.04,6.22 v35.04,8.53 | 36.05,5.95
  Bottom 0.254: v35.04,8.53 35.04,66.69 v31.19,70.54
VBAT  (via drill 0.35)
  Top 0.254: CHARGER.9 CHARGER.10 27.29,8.98 v27.29,9.29 | C5.1 11.67,18.31 | 11.67,18.31 11.8,18.18 REGULATOR.3 | REGULATOR.2 12.05,18.69 11.67,18.31
  Top 0.508: v26.66,12.34 26.66,14.73 25.17,16.22 23.72,16.22 23.48,15.98 23.48,15.56 19.89,11.96 14.65,11.96 L1.1 10.83,18.15 C5.1
  Bottom 0.254: v27.29,9.29 26.58,9.29
  Bottom 0.508: BATT.1 26.58,9.29 26.58,12.26 v26.66,12.34
VBUS  (2 unrouted)
  Top 0.254: C2.1 21.37,11.07 22.42,10.01 | 33.25,7.9 33.55,7.6 33.55,6.37 | 33.55,6.37 USB-C.B9 | USB-C.B4 38.05,5.57 37.32,4.84 34.2,4.84 33.41,5.63 33.41,6.23 33.55,6.37
  Top 0.305: 30.21,9.04 31.23,10.05 31.23,9.92 33.25,7.9 | 24.81,12.4 22.42,10.01 CHARGER.1 CHARGER.2
  Top 0.508: D1.2 24.45,12.77 24.81,12.4 26.15,11.07 31.23,11.07 31.23,10.05
X  (via drill 0.35)
  Top 0.254: X.1 53.56,52.67 R1.1 51.04,43.58 49.05,41.59 v49.05,41.55 | v49.01,33.42 38.85,33.42 35.42,36.85 IO_EXPANDER.7
  Bottom 0.254: v49.05,41.55 49.01,41.5 v49.01,33.42
Y  (via drill 0.35)
  Top 0.254: Y.1 44.66,43.78 R2.1 44.64,41.29 v46.72,41.29 | v46.72,32.4 38.59,32.4 34.15,36.85 IO_EXPANDER.8
  Bottom 0.254: v46.72,41.29 46.93,41.09 46.93,32.61 v46.72,32.4